# Altium schematic sheet [08] - Solar.SchDoc: =ProjectName
size A4; CheckedBy: Ven; Author: Ven; CompanyName: HUST; Revision: V.1.0
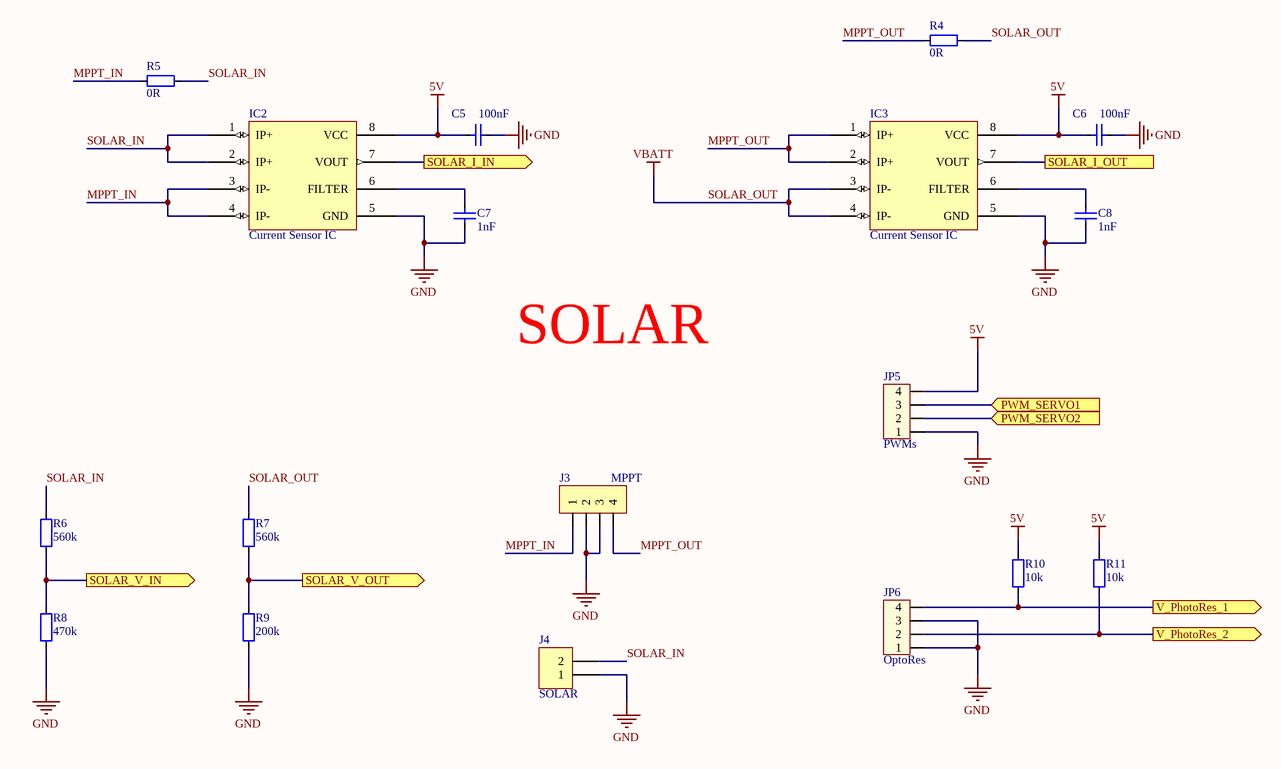
[diagram p0: [08] - Solar.SchDoc]

## Parts
C5  100nF  [CAP_0805]
C6  100nF  [CAP_0805]
C7  1nF  [CAP_0805]
C8  1nF  [CAP_0805]
IC2  Current Sensor IC  [SOIC-8]
IC3  Current Sensor IC  [SOIC-8]
J3  MPPT  [JP4-C1T]
J4  SOLAR  [KF2-5.08]
JP5  PWMs  [CON4]
JP6  OptoRes  [CON4]
R4  0R  [RES-SMD-0805]
R5  0R  [RES-SMD-0805]
R6  560k  [RES-SMD-0805]
R7  560k  [RES-SMD-0805]
R8  470k  [RES-SMD-0805]
R9  200k  [RES-SMD-0805]
R10  10k  [RES-SMD-0805]
R11  10k  [RES-SMD-0805]

## Ports
PWM_SERVO1 (in), PWM_SERVO2 (in), SOLAR_I_IN (out), SOLAR_I_OUT, SOLAR_V_IN (out), SOLAR_V_OUT (out), V_PhotoRes_1 (out), V_PhotoRes_2 (out)

## Nets
5V: C5.2 C6.2 IC2.8(VCC) IC3.8(VCC) JP5.4 R10.2 R11.2
GND: C5.1 C6.1 C7.1 C8.1 IC2.5(GND) IC3.5(GND) J3.2 J3.3 J4.1 JP5.1 JP6.1 JP6.3 R8.1 R9.1
SOLAR_OUT: IC3.3(IP-) IC3.4(IP-) R4.1 R7.2  [also labelled VBATT]
MPPT_IN: IC2.3(IP-) IC2.4(IP-) J3.1 R5.2
MPPT_OUT: IC3.1(IP+) IC3.2(IP+) J3.4 R4.2
PWM_SERVO1: JP5.3 ; port PWM_SERVO1
PWM_SERVO2: JP5.2 ; port PWM_SERVO2
SOLAR_I_IN: IC2.7(VOUT) ; port SOLAR_I_IN
SOLAR_I_OUT: IC3.7(VOUT) ; port SOLAR_I_OUT
SOLAR_IN: IC2.1(IP+) IC2.2(IP+) J4.2 R5.1 R6.2
SOLAR_V_IN: R6.1 R8.2 ; port SOLAR_V_IN
SOLAR_V_OUT: R7.1 R9.2 ; port SOLAR_V_OUT
V_PhotoRes_1: JP6.4 R10.1 ; port V_PhotoRes_1
V_PhotoRes_2: JP6.2 R11.1 ; port V_PhotoRes_2
NetC7_2: C7.2 IC2.6(FILTER)
NetC8_2: C8.2 IC3.6(FILTER)

## Notes on the sheet
- SOLAR
- Project:
- Page Contents:
- Size:
- Date:
- A4
- Checked by:
- Time:
- Revision:
- Sheet
- of
- File:

## Library data of the parts
C5-C8 = CapSMD: Capacitor; Value: 33p; Published: 8-Jun-2000; LatestRevisionDate: 17-Jul-2002; LatestRevisionNote: Re-released for DXP Platform.; PackageReference: RAD-0.3; Publisher: Altium Limited
IC2 IC3 = ACS712
J3 = JP4: WR-PHD 2.54 mm Angled Socket Header; Manufacturer: W¨¹rth Elektronik eiSos GmbH; partNo: 613004143121; ComponentLink1 Description: Manufacturer; ComponentLink2 Description: Datasheet; NoPins: 04; Created Date: 29 March 2013; ComponentLink1URL: http://www.we-online.com; ComponentLink2URL: http://katalog.we-online.de/em/datasheet/6130xx143121.pdf; Created by: Karrer Zheng
J4 = KF2: Manufacturer: Würth Elektronik eiSos GmbH; partNo: 691103110002; ComponentLink1 Description: Manufacturer; ComponentLink2 Description: Datasheet; NoPins: 2; Created Date: 29 October 2013; ComponentLink1URL: http://www.we-online.com; ComponentLink2URL: http://katalog.we-online.de/em/datasheet/6911031100xx.pdf; Created by: Karrer Zheng
JP5 JP6 = Con4: Connector 4; Value: Connector 4
R4-R11 = Resistor - SMD: Resistor; Manufacturer: Generic Components; Class: Passive; Published: 08/06/2000; Publisher: Altium Hobart Technology Centre